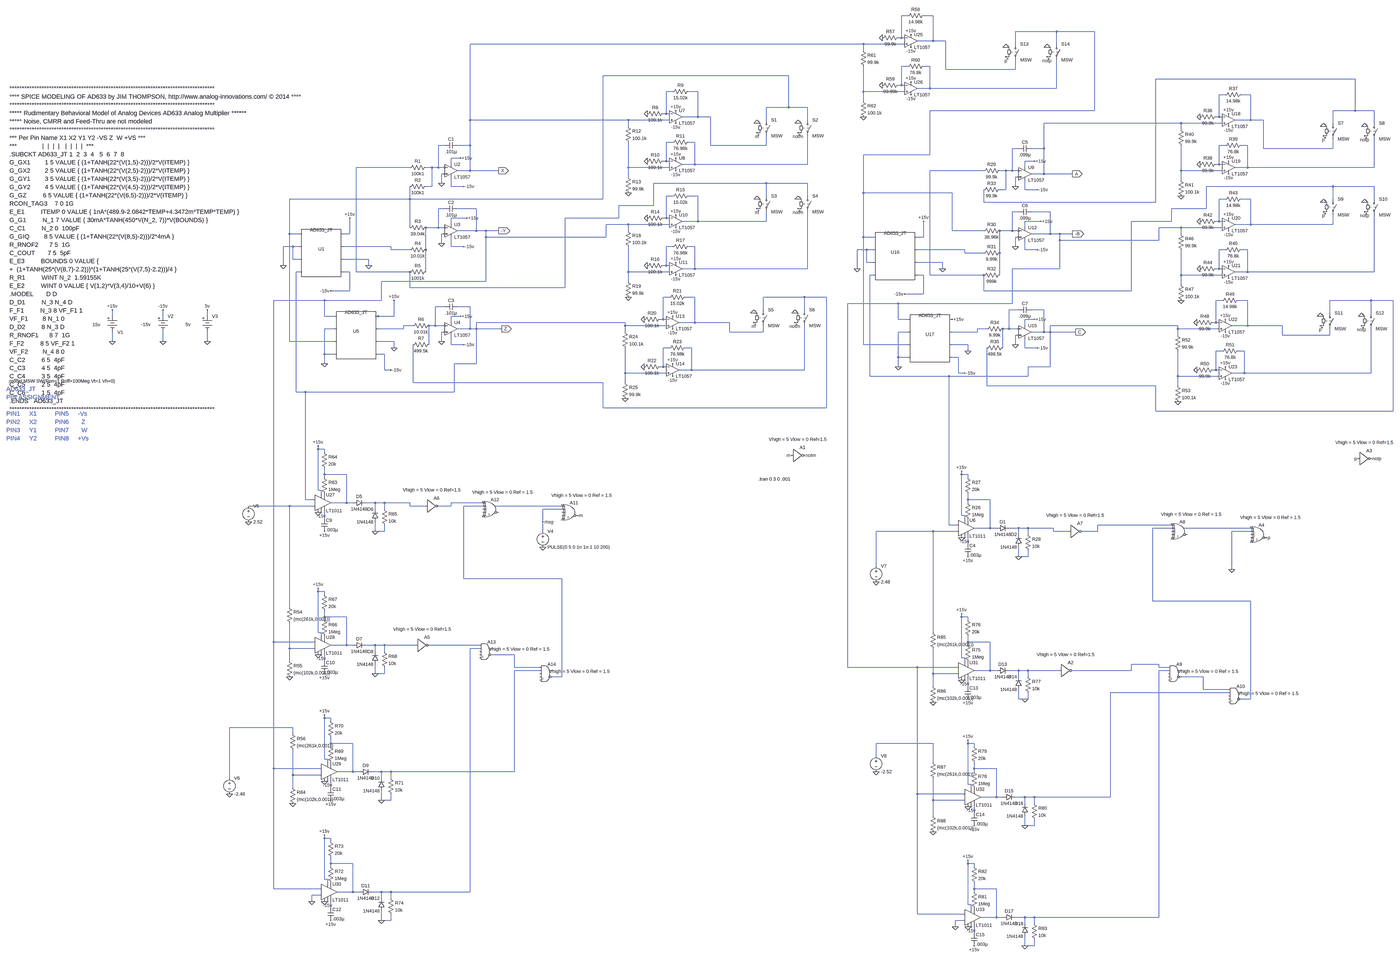
[diagram p0: schematic TSCSK_Real_WorstCase.asc, whole sheet]
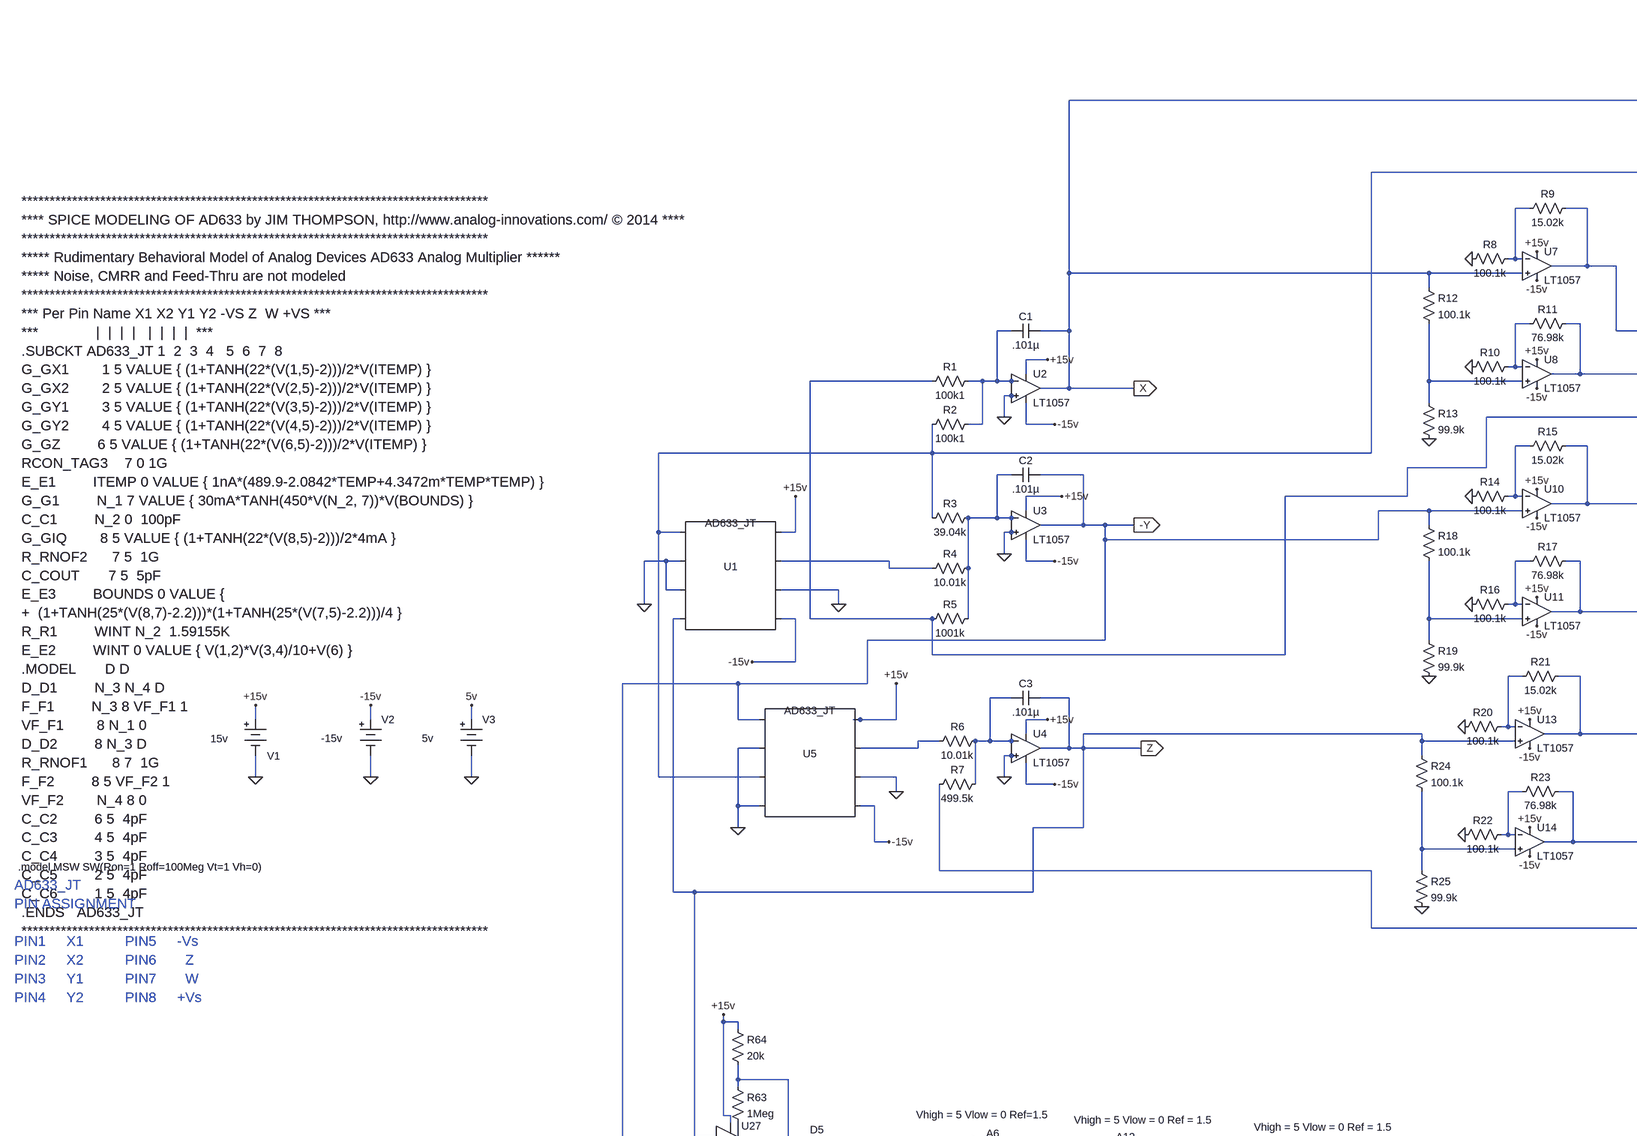
[diagram p1: schematic TSCSK_Real_WorstCase.asc, part, row 1 of 2, column 1 of 2]
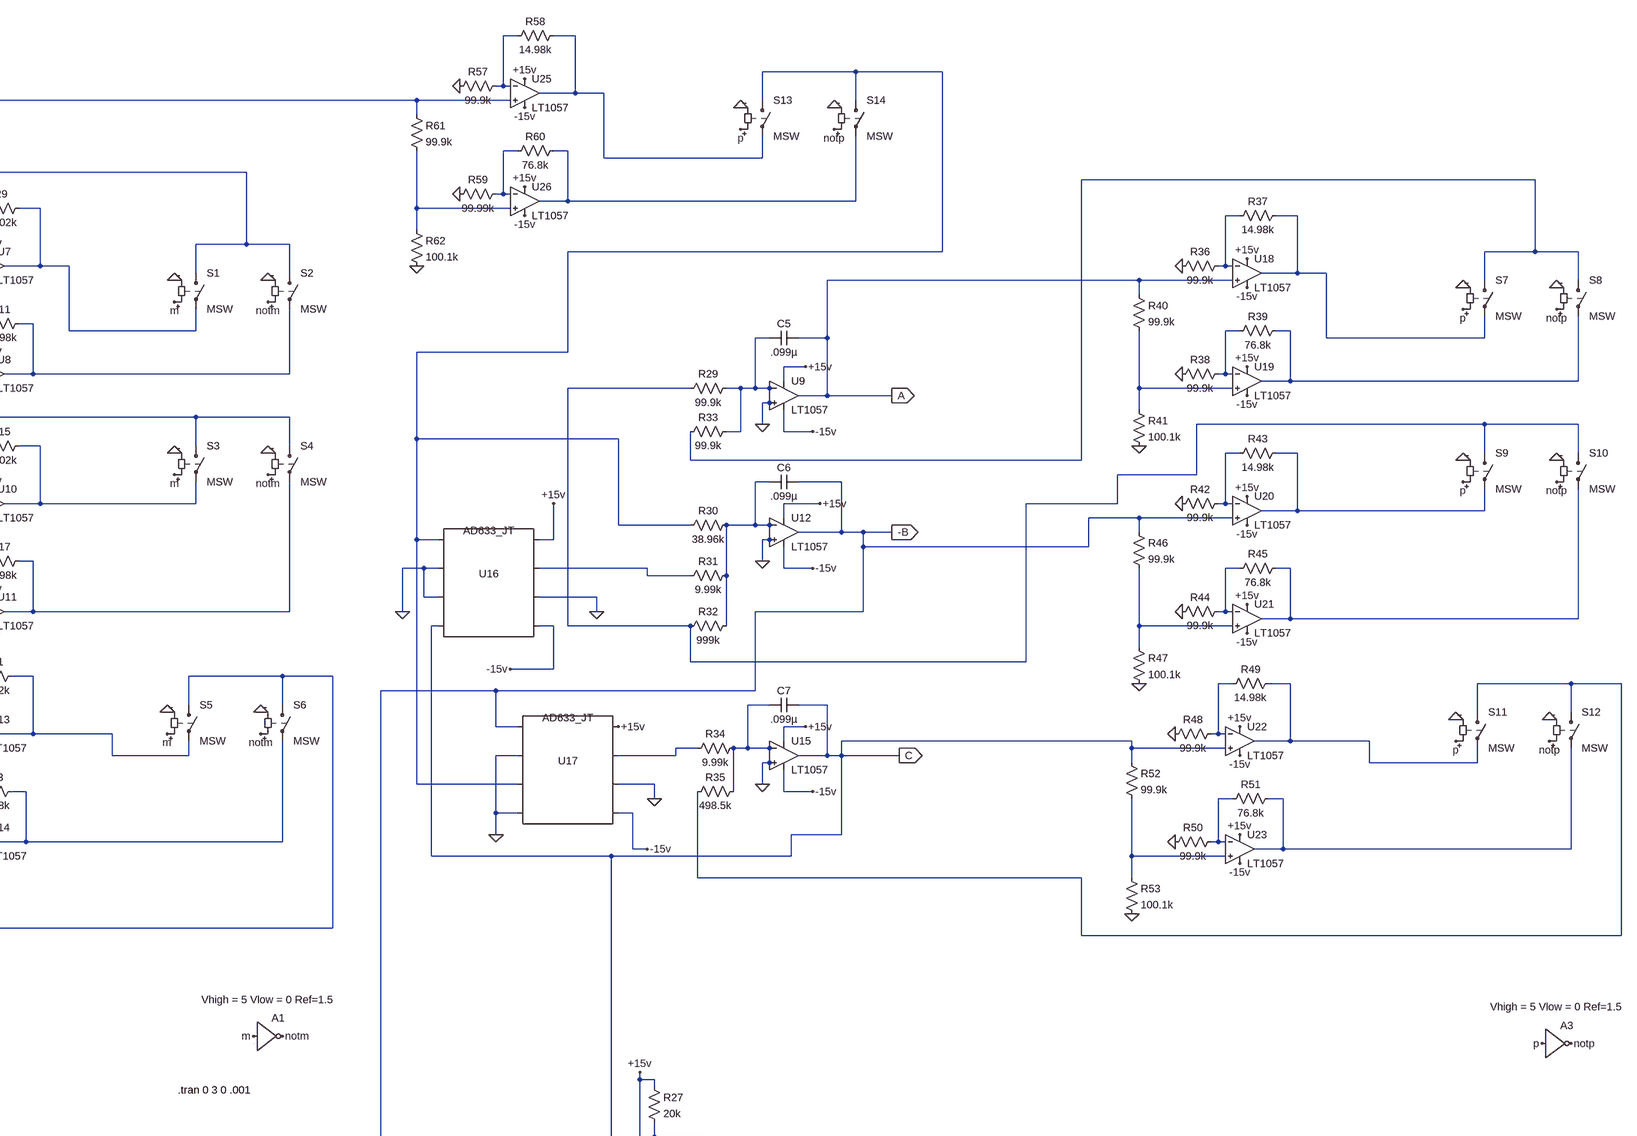
[diagram p2: schematic TSCSK_Real_WorstCase.asc, part, row 1 of 2, column 2 of 2]
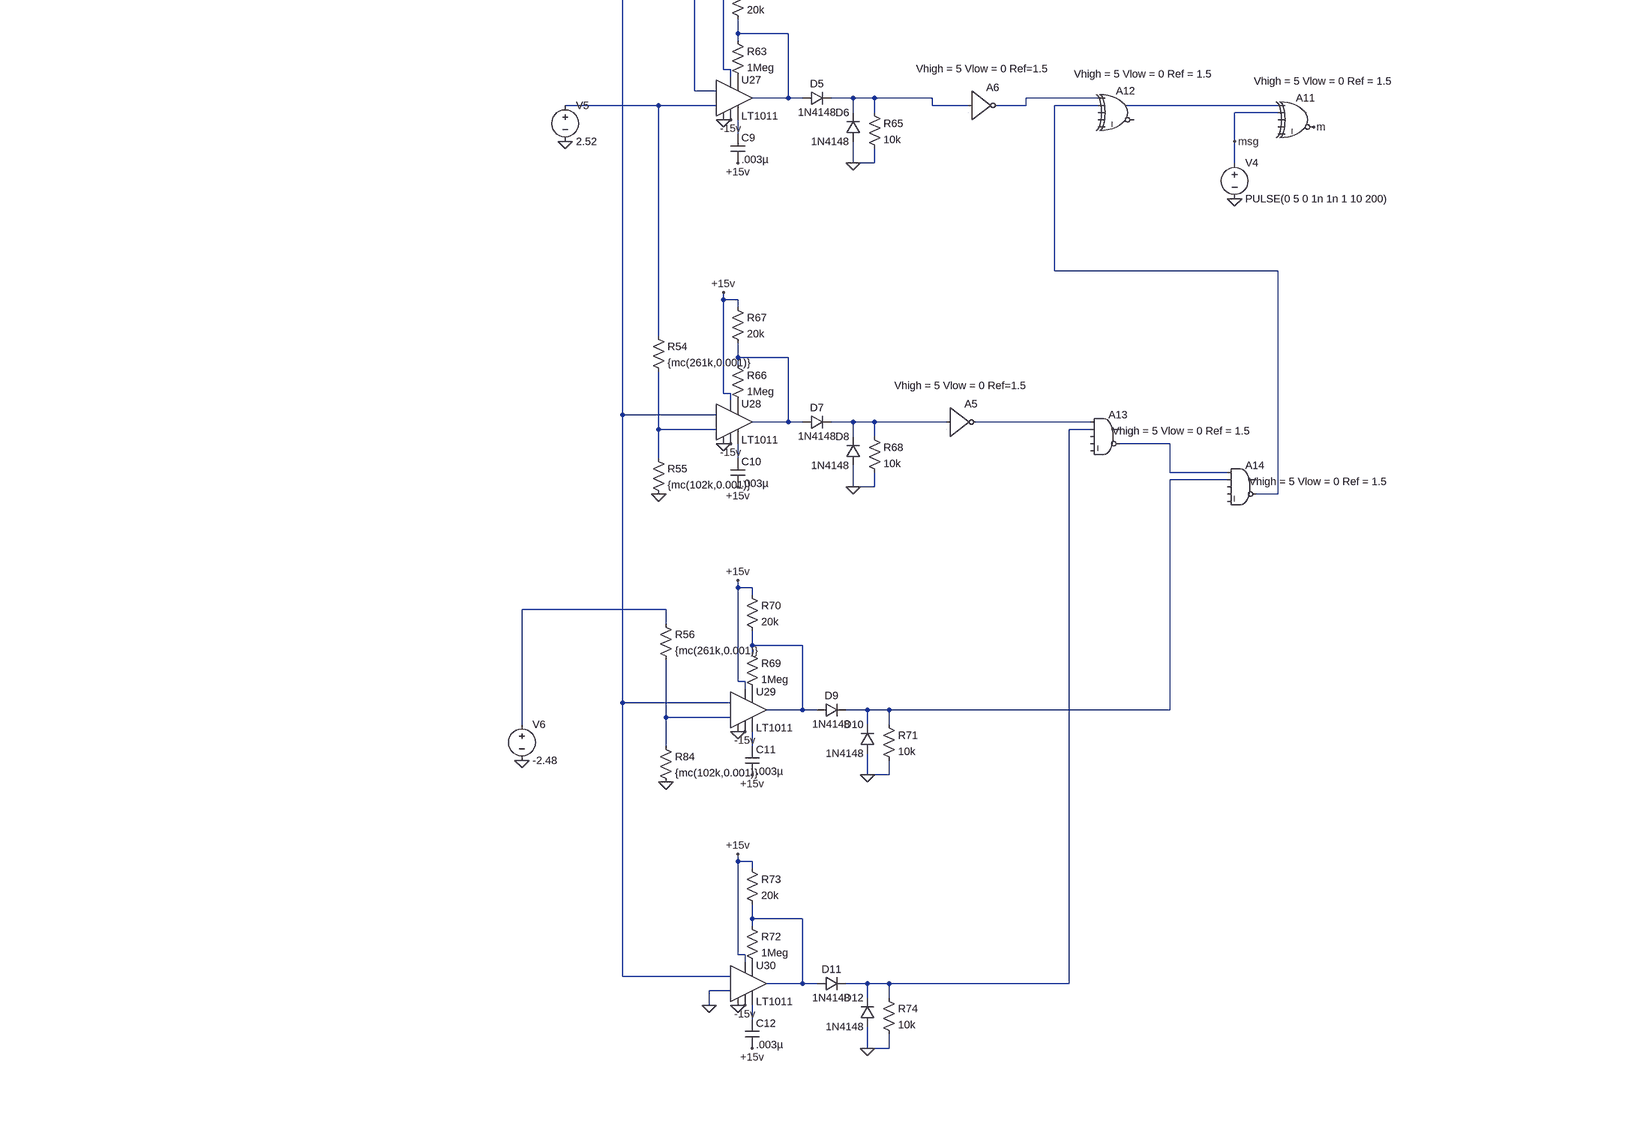
[diagram p3: schematic TSCSK_Real_WorstCase.asc, part, row 2 of 2, column 1 of 2]
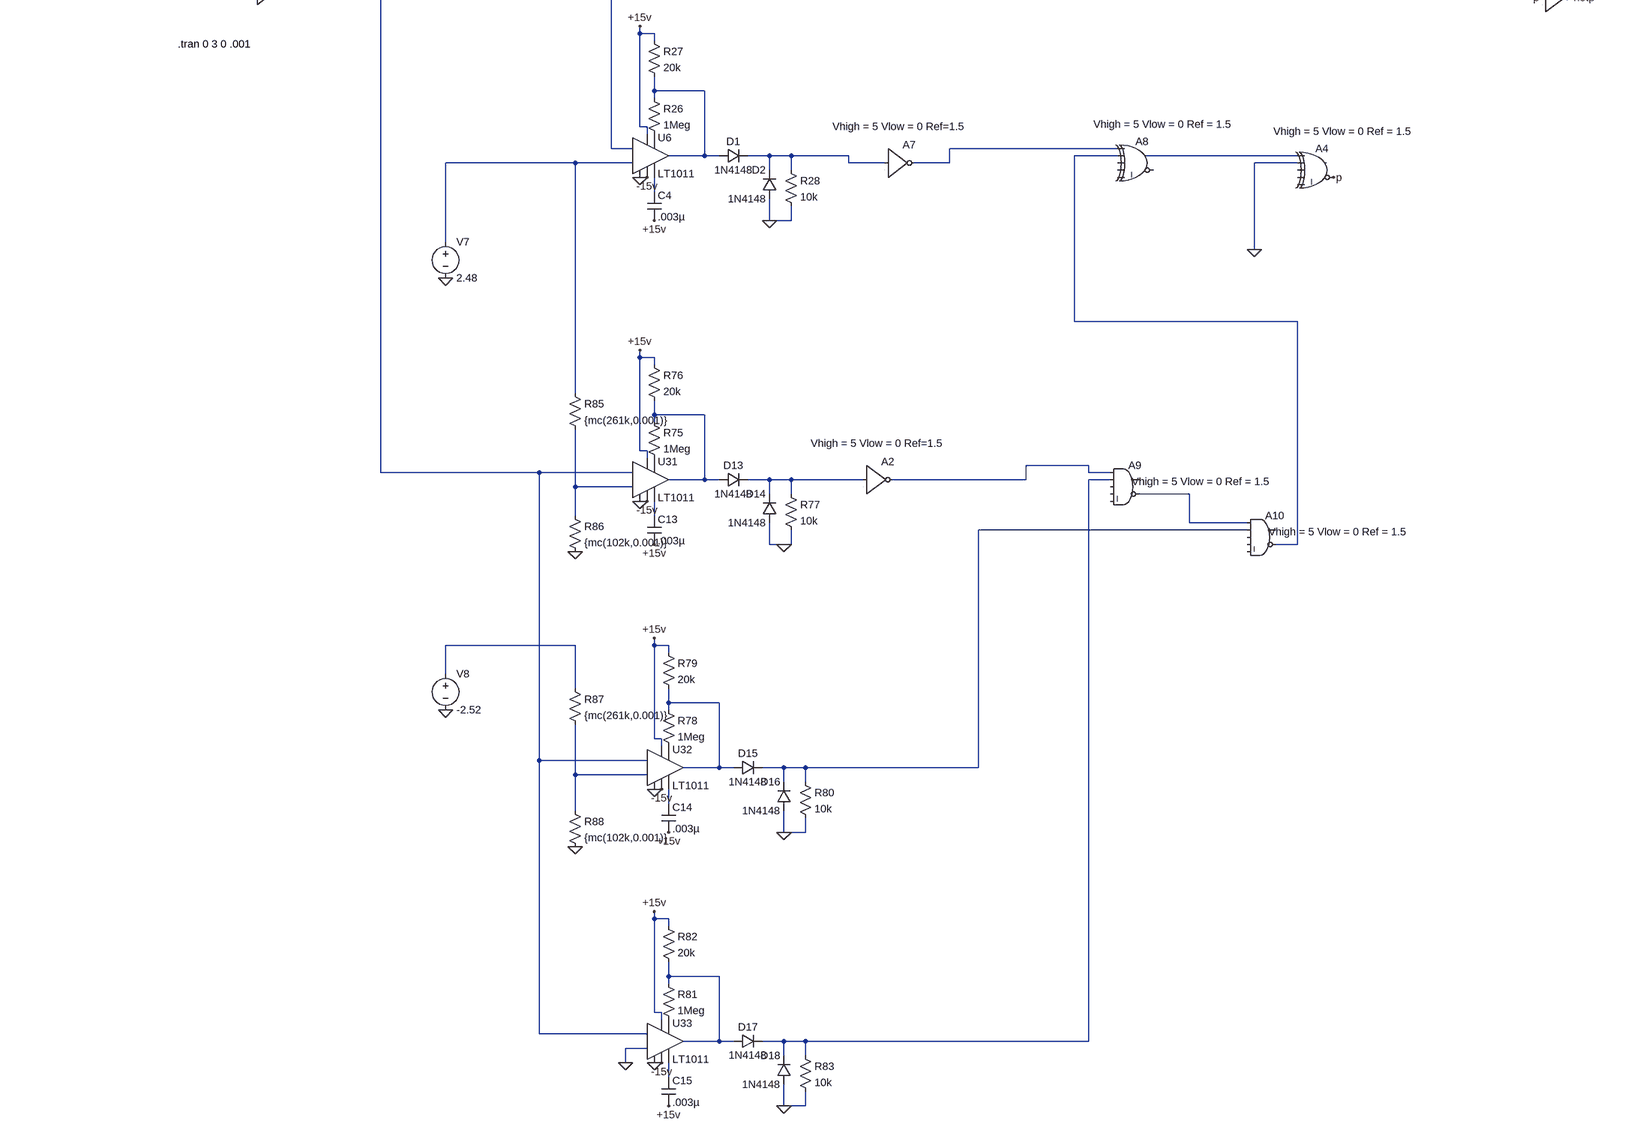
[diagram p4: schematic TSCSK_Real_WorstCase.asc, part, row 2 of 2, column 2 of 2]
* TSCSK_Real_WorstCase.asc
XU2 0 N015 +15v -15v X LT1057  ; pins In+ In- V+ V- OUT
XU3 0 N027 +15v -15v -Y LT1057  ; pins In+ In- V+ V- OUT
XU4 0 N043 +15v -15v Z LT1057  ; pins In+ In- V+ V- OUT
R1 N019 N015 100k1 tol=1
R3 N006 N027 39.04k tol=1
R4 N029 N027 10.01k tol=1
R5 N019 N027 1001k tol=1
R2 N006 N015 100k1 tol=1
C1 N015 X .101µ
C2 N027 -Y .101µ
C3 N043 Z .101µ
R6 N045 N043 10.01k tol=1
R7 N039 N043 499.5k tol=1
V1 +15v 0 15v
V2 -15v 0 -15v
XU1 N006 0 0 Z -15v 0 N029 +15v AD633_JT
XU5 -Y 0 N006 0 -15v 0 N045 +15v AD633_JT
V3 5v 0 5v
XU7 X N008 +15v -15v N009 LT1057  ; pins In+ In- V+ V- OUT
XU8 N020 N013 +15v -15v N014 LT1057  ; pins In+ In- V+ V- OUT
R8 N008 0 100.1k
R9 N009 N008 15.02k
R10 N013 0 100.1k
R11 N014 N013 76.98k
R12 X N020 100.1k
R13 N020 0 99.9k
XU10 -Y N023 +15v -15v N024 LT1057  ; pins In+ In- V+ V- OUT
XU11 N035 N030 +15v -15v N031 LT1057  ; pins In+ In- V+ V- OUT
R14 N023 0 100.1k
R15 N024 N023 15.02k
R16 N030 0 100.1k
R17 N031 N030 76.98k
R18 -Y N035 100.1k
R19 N035 0 99.9k
XU13 Z N037 +15v -15v N038 LT1057  ; pins In+ In- V+ V- OUT
XU14 N051 N047 +15v -15v N048 LT1057  ; pins In+ In- V+ V- OUT
R20 N037 0 100.1k
R21 N038 N037 15.02k
R22 N047 0 100.1k
R23 N048 N047 76.98k
R24 Z N051 100.1k
R25 N051 0 99.9k
S1 N006 N009 m 0 MSW
A1 m 0 0 0 0 notm 0 0 BUF Vhigh = 5 Vlow = 0 Ref=1.5 Trise = 1n Tfall = 1n Td =1n
S2 N006 N014 notm 0 MSW
S3 N019 N024 m 0 MSW
S4 N019 N031 notm 0 MSW
S5 N039 N038 m 0 MSW
S6 N039 N048 notm 0 MSW
XU9 0 N018 +15v -15v A LT1057  ; pins In+ In- V+ V- OUT
XU12 0 N028 +15v -15v -B LT1057  ; pins In+ In- V+ V- OUT
XU15 0 N044 +15v -15v C LT1057  ; pins In+ In- V+ V- OUT
R29 N021 N018 99.9k tol=1
R30 N003 N028 38.96k tol=1
R31 N032 N028 9.99k tol=1
R32 N021 N028 999k tol=1
R33 N007 N018 99.9k tol=1
C5 N018 A .099µ
C6 N028 -B .099µ
C7 N044 C .099µ
R34 N046 N044 9.99k tol=1
R35 N042 N044 498.5k tol=1
XU16 N003 0 0 C -15v 0 N032 +15v AD633_JT
XU17 -B 0 N003 0 -15v 0 N046 +15v AD633_JT
XU18 A N011 +15v -15v N012 LT1057  ; pins In+ In- V+ V- OUT
XU19 N022 N016 +15v -15v N017 LT1057  ; pins In+ In- V+ V- OUT
R36 N011 0 99.9k
R37 N012 N011 14.98k
R38 N016 0 99.9k
R39 N017 N016 76.8k
R40 A N022 99.9k
R41 N022 0 100.1k
XU20 -B N025 +15v -15v N026 LT1057  ; pins In+ In- V+ V- OUT
XU21 N036 N033 +15v -15v N034 LT1057  ; pins In+ In- V+ V- OUT
R42 N025 0 99.9k
R43 N026 N025 14.98k
R44 N033 0 99.9k
R45 N034 N033 76.8k
R46 -B N036 99.9k
R47 N036 0 100.1k
XU22 C N040 +15v -15v N041 LT1057  ; pins In+ In- V+ V- OUT
XU23 N052 N049 +15v -15v N050 LT1057  ; pins In+ In- V+ V- OUT
R48 N040 0 99.9k
R49 N041 N040 14.98k
R50 N049 0 99.9k
R51 N050 N049 76.8k
R52 C N052 99.9k
R53 N052 0 100.1k
S7 N007 N012 p 0 MSW
A3 p 0 0 0 0 notp 0 0 BUF Vhigh = 5 Vlow = 0 Ref=1.5 Trise = 1n Tfall = 1n Td =1n
S8 N007 N017 notp 0 MSW
S9 N021 N026 p 0 MSW
S10 N021 N034 notp 0 MSW
S11 N042 N041 p 0 MSW
S12 N042 N050 notp 0 MSW
XU25 X N001 +15v -15v N002 LT1057  ; pins In+ In- V+ V- OUT
XU26 N010 N004 +15v -15v N005 LT1057  ; pins In+ In- V+ V- OUT
R57 N001 0 99.9k
R58 N002 N001 14.98k
R59 N004 0 99.99k
R60 N005 N004 76.8k
R61 X N010 99.9k
R62 N010 0 100.1k
S13 N003 N002 p 0 MSW
S14 N003 N005 notp 0 MSW
XU27 0 N057 Z -15v P001 N060 N053 +15v LT1011
R63 N053 P001 1Meg
R64 +15v N053 20k
C9 N060 +15v .003µ
D5 N053 N055 1N4148
D6 0 N055 1N4148
R65 N055 0 10k
XU28 0 N071 -Y -15v P002 N074 N067 +15v LT1011
R66 N067 P002 1Meg
R67 +15v N067 20k
C10 N074 +15v .003µ
D7 N067 N069 1N4148
D8 0 N069 1N4148
R68 N069 0 10k
XU29 0 N087 -Y -15v P003 N088 N084 +15v LT1011
R69 N084 P003 1Meg
R70 +15v N084 20k
C11 N088 +15v .003µ
D9 N084 N076 1N4148
D10 0 N076 1N4148
R71 N076 0 10k
XU30 0 0 -Y -15v P004 N093 N091 +15v LT1011
R72 N091 P004 1Meg
R73 +15v N091 20k
C12 N093 +15v .003µ
D11 N091 N072 1N4148
D12 0 N072 1N4148
R74 N072 0 10k
A5 N069 0 0 0 0 N070 0 0 BUF Vhigh = 5 Vlow = 0 Ref=1.5 Trise = 1n Tfall = 1n Td =1n
A6 N055 0 0 0 0 N056 0 0 BUF Vhigh = 5 Vlow = 0 Ref=1.5 Trise = 1n Tfall = 1n Td =1n
XU6 0 N065 C -15v P005 N066 N054 +15v LT1011
R26 N054 P005 1Meg
R27 +15v N054 20k
C4 N066 +15v .003µ
D1 N054 N062 1N4148
D2 0 N062 1N4148
R28 N062 0 10k
XU31 0 N079 -B -15v P006 N081 N068 +15v LT1011
R75 N068 P006 1Meg
R76 +15v N068 20k
C13 N081 +15v .003µ
D13 N068 N077 1N4148
D14 0 N077 1N4148
R77 N077 0 10k
XU32 0 N089 -B -15v P007 N090 N086 +15v LT1011
R78 N086 P007 1Meg
R79 +15v N086 20k
C14 N090 +15v .003µ
D15 N086 N082 1N4148
D16 0 N082 1N4148
R80 N082 0 10k
XU33 0 0 -B -15v P008 N094 N092 +15v LT1011
R81 N092 P008 1Meg
R82 +15v N092 20k
C15 N094 +15v .003µ
D17 N092 N078 1N4148
D18 0 N078 1N4148
R83 N078 0 10k
A2 N077 0 0 0 0 N075 0 0 BUF Vhigh = 5 Vlow = 0 Ref=1.5 Trise = 1n Tfall = 1n Td =1n
A7 N062 0 0 0 0 N061 0 0 BUF Vhigh = 5 Vlow = 0 Ref=1.5 Trise = 1n Tfall = 1n Td =1n
A4 N064 0 0 0 0 p 0 0 XOR Vhigh = 5 Vlow = 0 Ref = 1.5
A8 N061 N063 0 0 0 0 N064 0 XOR Vhigh = 5 Vlow = 0 Ref = 1.5
A9 N075 N078 0 0 0 N080 0 0 AND Vhigh = 5 Vlow = 0 Ref = 1.5
A10 N080 N082 0 0 0 N063 0 0 AND Vhigh = 5 Vlow = 0 Ref = 1.5
V4 msg 0 PULSE(0 5 0 1n 1n 1 10 200)
A11 N059 msg 0 0 0 m 0 0 XOR Vhigh = 5 Vlow = 0 Ref = 1.5
A12 N056 N058 0 0 0 0 N059 0 XOR Vhigh = 5 Vlow = 0 Ref = 1.5
A13 N070 N072 0 0 0 N073 0 0 AND Vhigh = 5 Vlow = 0 Ref = 1.5
A14 N073 N076 0 0 0 N058 0 0 AND Vhigh = 5 Vlow = 0 Ref = 1.5
V5 N057 0 2.52
R54 N057 N071 {mc(261k,0.001)} tol=1
R55 N071 0 {mc(102k,0.001)} tol=1
V6 N083 0 -2.48
R56 N083 N087 {mc(261k,0.001)} tol=1
R84 N087 0 {mc(102k,0.001)} tol=1
R85 N065 N079 {mc(261k,0.001)} tol=1
R86 N079 0 {mc(102k,0.001)} tol=1
R87 N085 N089 {mc(261k,0.001)} tol=1
R88 N089 0 {mc(102k,0.001)} tol=1
V7 N065 0 2.48
V8 N085 0 -2.52
.model D D
.lib standard.dio
.tran 0 3 0 .001
***********************************************************************************
**** SPICE MODELING OF AD633 by JIM THOMPSON, http://www.analog-innovations.com/ © 2014 ****
***********************************************************************************
***** Rudimentary Behavioral Model of Analog Devices AD633 Analog Multiplier ******
***** Noise, CMRR and Feed-Thru are not modeled
***********************************************************************************
*** Per Pin Name X1 X2 Y1 Y2 -VS Z  W +VS ***
***              |  |  |  |   |  |  |  |  ***
.SUBCKT AD633_JT 1  2  3  4   5  6  7  8
G_GX1        1 5 VALUE { (1+TANH(22*(V(1,5)-2)))/2*V(ITEMP) }
G_GX2        2 5 VALUE { (1+TANH(22*(V(2,5)-2)))/2*V(ITEMP) }
G_GY1        3 5 VALUE { (1+TANH(22*(V(3,5)-2)))/2*V(ITEMP) }
G_GY2        4 5 VALUE { (1+TANH(22*(V(4,5)-2)))/2*V(ITEMP) }
G_GZ         6 5 VALUE { (1+TANH(22*(V(6,5)-2)))/2*V(ITEMP) }
RCON_TAG3    7 0 1G
E_E1         ITEMP 0 VALUE { 1nA*(489.9-2.0842*TEMP+4.3472m*TEMP*TEMP) }
G_G1         N_1 7 VALUE { 30mA*TANH(450*V(N_2, 7))*V(BOUNDS) }
C_C1         N_2 0  100pF
G_GIQ        8 5 VALUE { (1+TANH(22*(V(8,5)-2)))/2*4mA }
R_RNOF2      7 5  1G
C_COUT       7 5  5pF
E_E3         BOUNDS 0 VALUE {
+  (1+TANH(25*(V(8,7)-2.2)))*(1+TANH(25*(V(7,5)-2.2)))/4 }
R_R1         WINT N_2  1.59155K
E_E2         WINT 0 VALUE { V(1,2)*V(3,4)/10+V(6) }
.MODEL       D D
D_D1         N_3 N_4 D
F_F1         N_3 8 VF_F1 1
VF_F1        8 N_1 0
D_D2         8 N_3 D
R_RNOF1      8 7  1G
F_F2         8 5 VF_F2 1
VF_F2        N_4 8 0
C_C2         6 5  4pF
C_C3         4 5  4pF
C_C4         3 5  4pF
C_C5         2 5  4pF
C_C6         1 5  4pF
.ENDS   AD633_JT
***********************************************************************************
* AD633_JT
* PIN ASSIGNMENT
* PIN1     X1          PIN5     -Vs
* PIN2     X2          PIN6       Z
* PIN3     Y1          PIN7       W
* PIN4     Y2          PIN8     +Vs
.model MSW SW(Ron=1 Roff=100Meg Vt=1 Vh=0)
.lib LTC.lib
.lib LTC1.lib
.backanno
.end